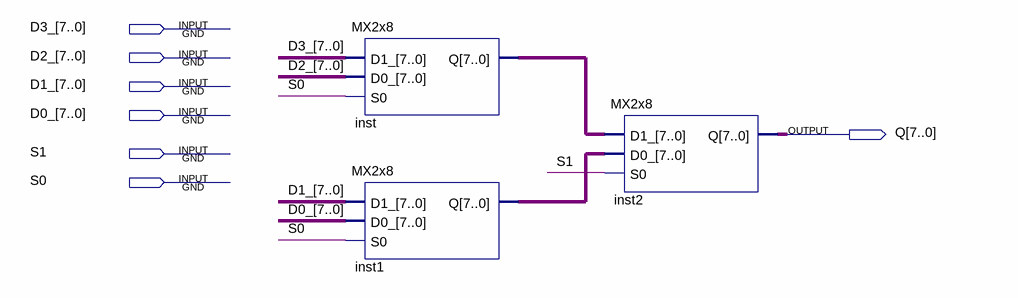
[diagram p0: schematic sheet]
// Quartus schematic MX4x8.bdf as structural Verilog: 3 symbols, 7 pins
module MX4x8 (
  input  [7:0] D3_,
  input  [7:0] D2_,
  input  [7:0] D1_,
  input  [7:0] D0_,
  input  S1,
  input  S0,
  output [7:0] Q
);

  wire [7:0] inst1_q, inst_q;

  MX2x8 inst (.D1_(D3_), .D0_(D2_), .S0(S0), .Q(inst_q));
  MX2x8 inst1 (.D1_(D1_), .D0_(D0_), .S0(S0), .Q(inst1_q));
  MX2x8 inst2 (.D1_(inst_q), .D0_(inst1_q), .S0(S1), .Q(Q));
endmodule
